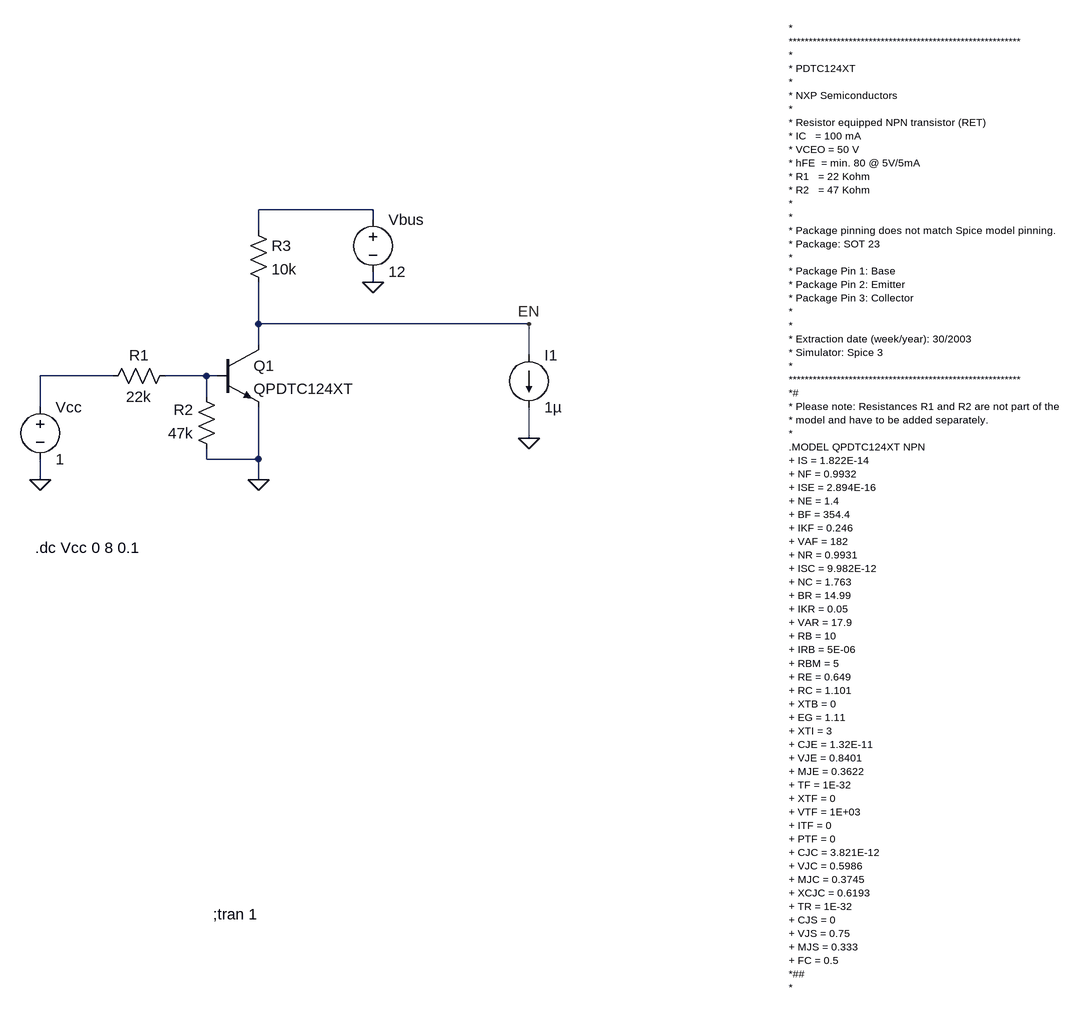
[diagram p0: schematic NPN_digital_transistor_as_inverter.asc]
NPN_digital_transistor_as_inverter.asc, the LTspice schematic file:
Version 4
SHEET 1 880 1484
WIRE -272 384 -448 384
WIRE -272 400 -272 384
WIRE -448 416 -448 384
WIRE -272 496 -272 480
WIRE -448 560 -448 496
WIRE -32 560 -448 560
WIRE -448 592 -448 560
WIRE -32 608 -32 560
WIRE -672 640 -784 640
WIRE -528 640 -592 640
WIRE -512 640 -528 640
WIRE -528 672 -528 640
WIRE -784 688 -784 640
WIRE -32 736 -32 688
WIRE -528 768 -528 752
WIRE -448 768 -448 688
WIRE -448 768 -528 768
WIRE -784 800 -784 768
WIRE -448 800 -448 768
FLAG -448 800 0
FLAG -784 800 0
FLAG -272 496 0
FLAG -32 736 0
FLAG -32 560 EN
SYMBOL npn -512 592 R0
SYMATTR InstName Q1
SYMATTR Value QPDTC124XT
SYMBOL res -576 624 R90
WINDOW 0 0 56 VBottom 2
WINDOW 3 32 56 VTop 2
SYMATTR InstName R1
SYMATTR Value 22k
SYMBOL res -512 768 R180
WINDOW 0 36 76 Left 2
WINDOW 3 36 40 Left 2
SYMATTR InstName R2
SYMATTR Value 47k
SYMBOL res -464 400 R0
SYMATTR InstName R3
SYMATTR Value 10k
SYMBOL voltage -272 384 R0
SYMATTR InstName Vbus
SYMATTR Value 12
SYMBOL voltage -784 672 R0
SYMATTR InstName Vcc
SYMATTR Value 1
SYMBOL current -32 608 R0
SYMATTR InstName I1
SYMATTR Value 1µ
TEXT 368 104 Left 1 !*\n**********************************************************\n*\n* PDTC124XT \n*\n* NXP Semiconductors\n*\n* Resistor equipped NPN transistor (RET)\n* IC   = 100 mA\n* VCEO = 50 V \n* hFE  = min. 80 @ 5V/5mA\n* R1   = 22 Kohm\n* R2   = 47 Kohm\n*\n*\n* Package pinning does not match Spice model pinning.\n* Package: SOT 23\n* \n* Package Pin 1: Base \n* Package Pin 2: Emitter\n* Package Pin 3: Collector \n*\n*\n* Extraction date (week/year): 30/2003\n* Simulator: Spice 3\n*\n**********************************************************\n*#\n* Please note: Resistances R1 and R2 are not part of the \n* model and have to be added separately.\n*\n.MODEL QPDTC124XT NPN\n+ IS = 1.822E-14 \n+ NF = 0.9932 \n+ ISE = 2.894E-16 \n+ NE = 1.4 \n+ BF = 354.4 \n+ IKF = 0.246 \n+ VAF = 182 \n+ NR = 0.9931 \n+ ISC = 9.982E-12 \n+ NC = 1.763 \n+ BR = 14.99 \n+ IKR = 0.05\n+ VAR = 17.9 \n+ RB = 10 \n+ IRB = 5E-06 \n+ RBM = 5 \n+ RE = 0.649 \n+ RC = 1.101 \n+ XTB = 0 \n+ EG = 1.11 \n+ XTI = 3 \n+ CJE = 1.32E-11 \n+ VJE = 0.8401 \n+ MJE = 0.3622 \n+ TF = 1E-32 \n+ XTF = 0 \n+ VTF = 1E+03 \n+ ITF = 0 \n+ PTF = 0 \n+ CJC = 3.821E-12 \n+ VJC = 0.5986 \n+ MJC = 0.3745 \n+ XCJC = 0.6193 \n+ TR = 1E-32\n+ CJS = 0 \n+ VJS = 0.75 \n+ MJS = 0.333 \n+ FC = 0.5\n*##\n*
TEXT -518 1468 Left 2 !;tran 1
TEXT -792 904 Left 2 !.dc Vcc 0 8 0.1

The netlist it stands for:
* NPN_digital_transistor_as_inverter.asc
Q1 EN N003 0 0 QPDTC124XT
R1 N003 N002 22k
R2 0 N003 47k
R3 N001 EN 10k
Vbus N001 0 12
Vcc N002 0 1
I1 EN 0 1µ
.model NPN NPN
.model PNP PNP
.lib standard.bjt
*
**********************************************************
*
* PDTC124XT
*
* NXP Semiconductors
*
* Resistor equipped NPN transistor (RET)
* IC   = 100 mA
* VCEO = 50 V
* hFE  = min. 80 @ 5V/5mA
* R1   = 22 Kohm
* R2   = 47 Kohm
*
*
* Package pinning does not match Spice model pinning.
* Package: SOT 23
*
* Package Pin 1: Base
* Package Pin 2: Emitter
* Package Pin 3: Collector
*
*
* Extraction date (week/year): 30/2003
* Simulator: Spice 3
*
**********************************************************
*#
* Please note: Resistances R1 and R2 are not part of the
* model and have to be added separately.
*
.MODEL QPDTC124XT NPN
+ IS = 1.822E-14
+ NF = 0.9932
+ ISE = 2.894E-16
+ NE = 1.4
+ BF = 354.4
+ IKF = 0.246
+ VAF = 182
+ NR = 0.9931
+ ISC = 9.982E-12
+ NC = 1.763
+ BR = 14.99
+ IKR = 0.05
+ VAR = 17.9
+ RB = 10
+ IRB = 5E-06
+ RBM = 5
+ RE = 0.649
+ RC = 1.101
+ XTB = 0
+ EG = 1.11
+ XTI = 3
+ CJE = 1.32E-11
+ VJE = 0.8401
+ MJE = 0.3622
+ TF = 1E-32
+ XTF = 0
+ VTF = 1E+03
+ ITF = 0
+ PTF = 0
+ CJC = 3.821E-12
+ VJC = 0.5986
+ MJC = 0.3745
+ XCJC = 0.6193
+ TR = 1E-32
+ CJS = 0
+ VJS = 0.75
+ MJS = 0.333
+ FC = 0.5
*##
*
;tran 1
.dc Vcc 0 8 0.1
.backanno
.end